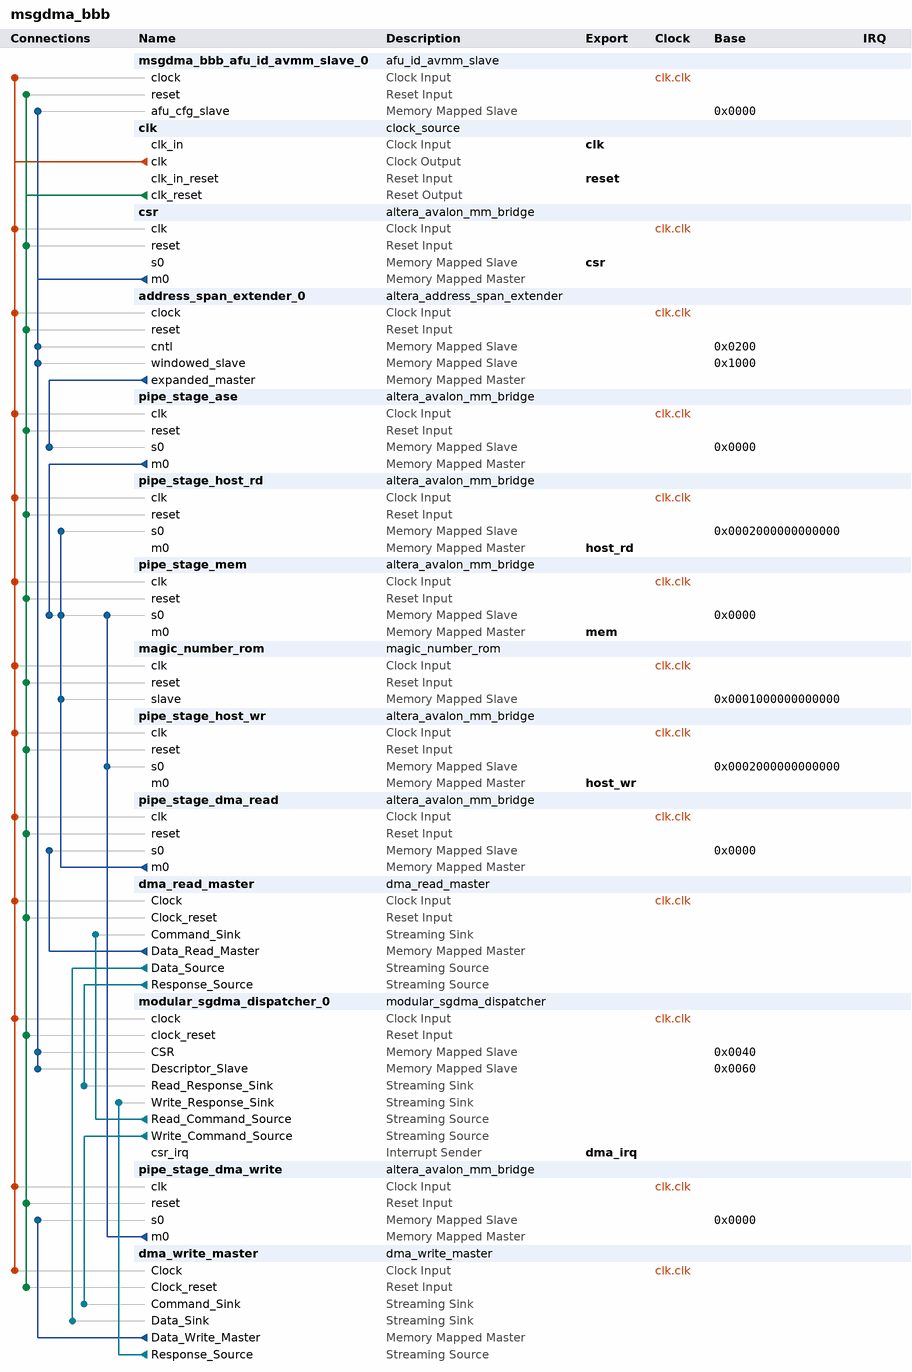
[diagram p0: system contents]
# Platform Designer (Qsys) system msgdma_bbb, Arria 10 10AX115N3F40E2SG
# Parameters at their usual value, and those the tool derives, are not listed.
package require -exact qsys 1.0
create_system msgdma_bbb
set_project_property DEVICE_FAMILY {Arria 10}
set_project_property DEVICE 10AX115N3F40E2SG

add_component msgdma_bbb_afu_id_avmm_slave_0 ip/msgdma_bbb/msgdma_bbb_afu_id_avmm_slave_0.ip afu_id_avmm_slave msgdma_bbb_afu_id_avmm_slave_0 1.0
load_component msgdma_bbb_afu_id_avmm_slave_0
set_component_parameter_value AFU_ID_H 17258601878618128636
set_component_parameter_value AFU_ID_L 12183532447502041578
set_component_parameter_value DFH_FEATURE_TYPE 2
set_component_parameter_value DFH_AFU_MINOR_REV 0
set_component_parameter_value DFH_AFU_MAJOR_REV 0
set_component_parameter_value DFH_END_OF_LIST 1
set_component_parameter_value DFH_NEXT_OFFSET 8192
set_component_parameter_value DFH_FEATURE_ID 0
set_component_parameter_value NEXT_AFU_OFFSET 0
set_component_parameter_value CREATE_SCRATCH_REG 0
save_component

add_component clk ip/msgdma_bbb/msgdma_bbb_clk.ip clock_source clk 

add_component csr ip/msgdma_bbb/msgdma_bbb_csr.ip altera_avalon_mm_bridge csr 17.0
load_component csr
set_component_parameter_value DATA_WIDTH 64
set_component_parameter_value ADDRESS_WIDTH 13
set_component_parameter_value USE_AUTO_ADDRESS_WIDTH 0
set_component_parameter_value ADDRESS_UNITS SYMBOLS
set_component_parameter_value MAX_PENDING_RESPONSES 1
save_component

add_component address_span_extender_0 ip/msgdma_bbb/msgdma_bbb_address_span_extender_0.ip altera_address_span_extender address_span_extender_0 17.0

add_component pipe_stage_ase ip/msgdma_bbb/msgdma_bbb_pipe_stage_0.ip altera_avalon_mm_bridge pipe_stage_ase 17.0
load_component pipe_stage_ase
set_component_parameter_value DATA_WIDTH 512
set_component_parameter_value ADDRESS_WIDTH 48
set_component_parameter_value USE_AUTO_ADDRESS_WIDTH 0
set_component_parameter_value ADDRESS_UNITS SYMBOLS
set_component_parameter_value MAX_PENDING_RESPONSES 16
set_component_parameter_value PIPELINE_COMMAND 0
save_component

add_component pipe_stage_host_rd ip/msgdma_bbb/msgdma_bbb_pipe_stage_m.ip altera_avalon_mm_bridge pipe_stage_host_rd 17.0
load_component pipe_stage_host_rd
set_component_parameter_value DATA_WIDTH 512
set_component_parameter_value ADDRESS_WIDTH 48
set_component_parameter_value USE_AUTO_ADDRESS_WIDTH 0
set_component_parameter_value ADDRESS_UNITS SYMBOLS
set_component_parameter_value MAX_BURST_SIZE 4
set_component_parameter_value MAX_PENDING_RESPONSES 64
save_component

add_component pipe_stage_mem ip/msgdma_bbb/msgdma_bbb_mm_bridge_0.ip altera_avalon_mm_bridge pipe_stage_mem 17.0

add_component magic_number_rom ip/msgdma_bbb/msgdma_bbb_magic_number_rom_0.ip magic_number_rom magic_number_rom 1.0

add_component pipe_stage_host_wr ip/msgdma_bbb/msgdma_bbb_mm_bridge_1.ip altera_avalon_mm_bridge pipe_stage_host_wr 17.0

add_component pipe_stage_dma_read ip/msgdma_bbb/dma_core_pipe_stage_dma_read.ip altera_avalon_mm_bridge pipe_stage_dma_read 17.0

add_component dma_read_master ip/msgdma_bbb/dma_core_dma_read_master.ip dma_read_master dma_read_master 17.0

add_component modular_sgdma_dispatcher_0 ip/msgdma_bbb/dma_core_modular_sgdma_dispatcher_0.ip modular_sgdma_dispatcher modular_sgdma_dispatcher_0 17.0

add_component pipe_stage_dma_write ip/msgdma_bbb/dma_core_pipe_stage_dma_write.ip altera_avalon_mm_bridge pipe_stage_dma_write 17.0
load_component pipe_stage_dma_write
set_component_parameter_value DATA_WIDTH 512
set_component_parameter_value ADDRESS_WIDTH 50
set_component_parameter_value USE_AUTO_ADDRESS_WIDTH 0
set_component_parameter_value ADDRESS_UNITS SYMBOLS
set_component_parameter_value MAX_BURST_SIZE 4
set_component_parameter_value MAX_PENDING_RESPONSES 64
save_component

add_component dma_write_master ip/msgdma_bbb/dma_core_dma_write_master.ip dma_write_master dma_write_master 17.0

# connections
add_connection clk.clk address_span_extender_0.clock clock
add_connection clk.clk csr.clk clock
add_connection clk.clk dma_read_master.Clock clock
add_connection clk.clk dma_write_master.Clock clock
add_connection clk.clk magic_number_rom.clk clock
add_connection clk.clk modular_sgdma_dispatcher_0.clock clock
add_connection clk.clk msgdma_bbb_afu_id_avmm_slave_0.clock clock
add_connection clk.clk pipe_stage_ase.clk clock
add_connection clk.clk pipe_stage_dma_read.clk clock
add_connection clk.clk pipe_stage_dma_write.clk clock
add_connection clk.clk pipe_stage_host_rd.clk clock
add_connection clk.clk pipe_stage_host_wr.clk clock
add_connection clk.clk pipe_stage_mem.clk clock
add_connection clk.clk_reset address_span_extender_0.reset reset
add_connection clk.clk_reset csr.reset reset
add_connection clk.clk_reset dma_read_master.Clock_reset reset
add_connection clk.clk_reset dma_write_master.Clock_reset reset
add_connection clk.clk_reset magic_number_rom.reset reset
add_connection clk.clk_reset modular_sgdma_dispatcher_0.clock_reset reset
add_connection clk.clk_reset msgdma_bbb_afu_id_avmm_slave_0.reset reset
add_connection clk.clk_reset pipe_stage_ase.reset reset
add_connection clk.clk_reset pipe_stage_dma_read.reset reset
add_connection clk.clk_reset pipe_stage_dma_write.reset reset
add_connection clk.clk_reset pipe_stage_host_rd.reset reset
add_connection clk.clk_reset pipe_stage_host_wr.reset reset
add_connection clk.clk_reset pipe_stage_mem.reset reset
add_connection address_span_extender_0.expanded_master pipe_stage_ase.s0 avalon
set_connection_parameter_value address_span_extender_0.expanded_master/pipe_stage_ase.s0 baseAddress 0x0000
add_connection csr.m0 address_span_extender_0.cntl avalon
set_connection_parameter_value csr.m0/address_span_extender_0.cntl baseAddress 0x0200
add_connection csr.m0 address_span_extender_0.windowed_slave avalon
set_connection_parameter_value csr.m0/address_span_extender_0.windowed_slave baseAddress 0x1000
add_connection csr.m0 modular_sgdma_dispatcher_0.CSR avalon
set_connection_parameter_value csr.m0/modular_sgdma_dispatcher_0.CSR baseAddress 0x0040
add_connection csr.m0 modular_sgdma_dispatcher_0.Descriptor_Slave avalon
set_connection_parameter_value csr.m0/modular_sgdma_dispatcher_0.Descriptor_Slave baseAddress 0x0060
add_connection csr.m0 msgdma_bbb_afu_id_avmm_slave_0.afu_cfg_slave avalon
set_connection_parameter_value csr.m0/msgdma_bbb_afu_id_avmm_slave_0.afu_cfg_slave baseAddress 0x0000
add_connection dma_read_master.Data_Read_Master pipe_stage_dma_read.s0 avalon
set_connection_parameter_value dma_read_master.Data_Read_Master/pipe_stage_dma_read.s0 baseAddress 0x0000
add_connection dma_write_master.Data_Write_Master pipe_stage_dma_write.s0 avalon
set_connection_parameter_value dma_write_master.Data_Write_Master/pipe_stage_dma_write.s0 baseAddress 0x0000
add_connection pipe_stage_ase.m0 pipe_stage_mem.s0 avalon
set_connection_parameter_value pipe_stage_ase.m0/pipe_stage_mem.s0 baseAddress 0x0000
add_connection pipe_stage_dma_read.m0 magic_number_rom.slave avalon
set_connection_parameter_value pipe_stage_dma_read.m0/magic_number_rom.slave baseAddress 0x0001000000000000
add_connection pipe_stage_dma_read.m0 pipe_stage_host_rd.s0 avalon
set_connection_parameter_value pipe_stage_dma_read.m0/pipe_stage_host_rd.s0 baseAddress 0x0002000000000000
add_connection pipe_stage_dma_read.m0 pipe_stage_mem.s0 avalon
set_connection_parameter_value pipe_stage_dma_read.m0/pipe_stage_mem.s0 baseAddress 0x0000
add_connection pipe_stage_dma_write.m0 pipe_stage_host_wr.s0 avalon
set_connection_parameter_value pipe_stage_dma_write.m0/pipe_stage_host_wr.s0 baseAddress 0x0002000000000000
add_connection pipe_stage_dma_write.m0 pipe_stage_mem.s0 avalon
set_connection_parameter_value pipe_stage_dma_write.m0/pipe_stage_mem.s0 baseAddress 0x0000
add_connection dma_read_master.Data_Source dma_write_master.Data_Sink avalon_streaming
add_connection dma_read_master.Response_Source modular_sgdma_dispatcher_0.Read_Response_Sink avalon_streaming
add_connection dma_write_master.Response_Source modular_sgdma_dispatcher_0.Write_Response_Sink avalon_streaming
add_connection modular_sgdma_dispatcher_0.Read_Command_Source dma_read_master.Command_Sink avalon_streaming
add_connection modular_sgdma_dispatcher_0.Write_Command_Source dma_write_master.Command_Sink avalon_streaming

# exported interfaces
add_interface clk clock sink
set_interface_property clk EXPORT_OF clk.clk_in
add_interface csr avalon slave
set_interface_property csr EXPORT_OF csr.s0
add_interface dma_irq interrupt sender
set_interface_property dma_irq EXPORT_OF modular_sgdma_dispatcher_0.csr_irq
add_interface host_rd avalon master
set_interface_property host_rd EXPORT_OF pipe_stage_host_rd.m0
add_interface host_wr avalon master
set_interface_property host_wr EXPORT_OF pipe_stage_host_wr.m0
add_interface mem avalon master
set_interface_property mem EXPORT_OF pipe_stage_mem.m0
add_interface reset reset sink
set_interface_property reset EXPORT_OF clk.clk_in_reset

set_interconnect_requirement {$system} qsys_mm.clockCrossingAdapter HANDSHAKE
set_interconnect_requirement {$system} qsys_mm.enableEccProtection FALSE
set_interconnect_requirement {$system} qsys_mm.insertDefaultSlave FALSE
set_interconnect_requirement {$system} qsys_mm.maxAdditionalLatency 0

save_system msgdma_bbb.qsys
